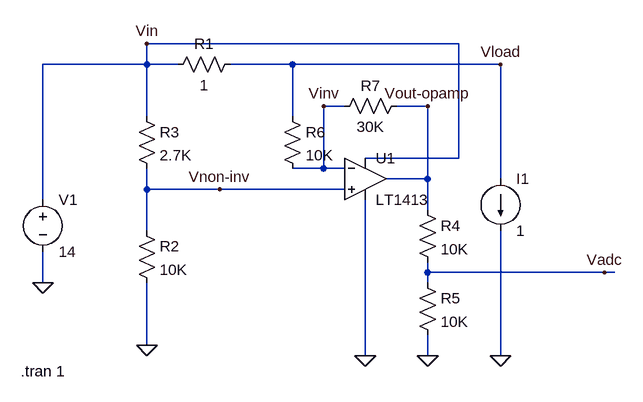
[diagram p0: schematic current_sense_arduino.asc]
current_sense_arduino.asc, the LTspice schematic file:
Version 4
SHEET 1 1080 680
WIRE 768 -64 288 -64
WIRE 288 -32 288 -64
WIRE 288 -32 128 -32
WIRE 336 -32 288 -32
WIRE 512 -32 416 -32
WIRE 832 -32 512 -32
WIRE 592 32 560 32
WIRE 720 32 672 32
WIRE 288 48 288 -32
WIRE 512 48 512 -32
WIRE 768 112 768 -64
WIRE 768 112 624 112
WIRE 560 128 560 32
WIRE 560 128 512 128
WIRE 592 128 560 128
WIRE 720 144 720 32
WIRE 720 144 656 144
WIRE 832 144 832 -32
WIRE 288 160 288 128
WIRE 400 160 288 160
WIRE 592 160 400 160
WIRE 128 176 128 -32
WIRE 720 192 720 144
WIRE 288 224 288 160
WIRE 720 288 720 272
WIRE 992 288 720 288
WIRE 1008 288 992 288
WIRE 128 304 128 256
WIRE 720 304 720 288
WIRE 288 400 288 304
WIRE 624 416 624 176
WIRE 720 416 720 384
WIRE 832 416 832 224
FLAG 128 304 0
FLAG 832 416 0
FLAG 720 416 0
FLAG 624 416 0
FLAG 400 160 Vnon-inv
FLAG 560 32 Vinv
FLAG 288 -64 Vin
FLAG 832 -32 Vload
FLAG 720 32 Vout-opamp
FLAG 992 288 Vadc
FLAG 288 400 0
SYMBOL voltage 128 160 R0
WINDOW 123 0 0 Left 0
WINDOW 39 0 0 Left 0
SYMATTR InstName V1
SYMATTR Value 14
SYMBOL res 432 -48 R90
WINDOW 0 0 56 VBottom 2
WINDOW 3 32 56 VTop 2
SYMATTR InstName R1
SYMATTR Value 1
SYMATTR SpiceLine pwr=5W
SYMBOL res 272 32 R0
SYMATTR InstName R3
SYMATTR Value 2.7K
SYMBOL res 496 32 R0
SYMATTR InstName R6
SYMATTR Value 10K
SYMBOL res 688 16 R90
WINDOW 0 0 56 VBottom 2
WINDOW 3 32 56 VTop 2
SYMATTR InstName R7
SYMATTR Value 30K
SYMBOL Opamps\\LT1413 624 80 R0
SYMATTR InstName U1
SYMBOL res 704 176 R0
SYMATTR InstName R4
SYMATTR Value 10K
SYMBOL res 704 288 R0
SYMATTR InstName R5
SYMATTR Value 10K
SYMBOL current 832 144 R0
WINDOW 123 0 0 Left 0
WINDOW 39 0 0 Left 0
SYMATTR InstName I1
SYMATTR Value 1
SYMBOL res 272 208 R0
SYMATTR InstName R2
SYMATTR Value 10K
TEXT 94 440 Left 2 !.tran 1

The netlist it stands for:
* current_sense_arduino.asc
V1 Vin 0 14
R1 Vload Vin 1 pwr=5W
R3 Vin Vnon-inv 2.7K
R6 Vload Vinv 10K
R7 Vout-opamp Vinv 30K
XU1 Vnon-inv Vinv Vin 0 Vout-opamp LT1413  ; pins In+ In- V+ V- OUT
R4 Vout-opamp Vadc 10K
R5 Vadc 0 10K
I1 Vload 0 1
R2 Vnon-inv 0 10K
.tran 1
.lib LTC.lib
.backanno
.end